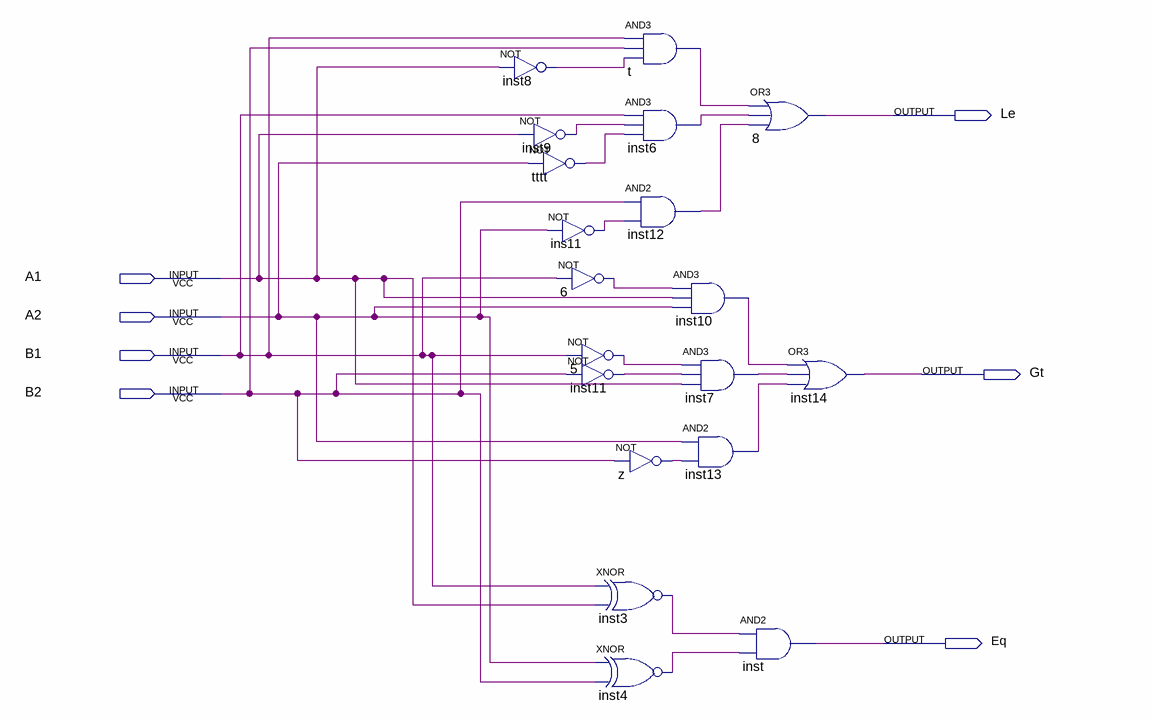
[diagram p0: schematic sheet]
// Quartus schematic 2bitComp.bdf as structural Verilog: 19 symbols, 7 pins
module \2bitComp  (
  input  A1,
  input  A2,
  input  B1,
  input  B2,
  output Le,
  output Gt,
  output Eq
);

  wire ins11_out, inst3_out, inst4_out, inst6_out, inst7_out, inst8_out, inst9_out, inst10_out, inst11_out,
       inst12_out, inst13_out, n5_out, n6_out, t_out, tttt_out, z_out;

  not inst8 (inst8_out, A1);
  not inst9 (inst9_out, A1);
  not tttt (tttt_out, A2);
  not ins11 (ins11_out, A2);
  not u_6 (n6_out, B1);
  not u_5 (n5_out, B1);
  not inst11 (inst11_out, B2);
  not z (z_out, B2);
  xnor inst3 (inst3_out, B1, A1);
  xnor inst4 (inst4_out, A2, B2);
  and t (t_out, B1, B2, inst8_out);
  and inst6 (inst6_out, B1, inst9_out, tttt_out);
  and inst12 (inst12_out, B2, ins11_out);
  and inst10 (inst10_out, n6_out, A1, A2);
  and inst7 (inst7_out, n5_out, inst11_out, A1);
  and inst13 (inst13_out, A2, z_out);
  or u_8 (Le, t_out, inst6_out, inst12_out);
  and inst (Eq, inst3_out, inst4_out);
  or inst14 (Gt, inst10_out, inst7_out, inst13_out);
endmodule
